# Altium schematic sheet 0.Block_Diagram_main.SchDoc
size A4; SheetNumber: 1; SheetTotal: 7
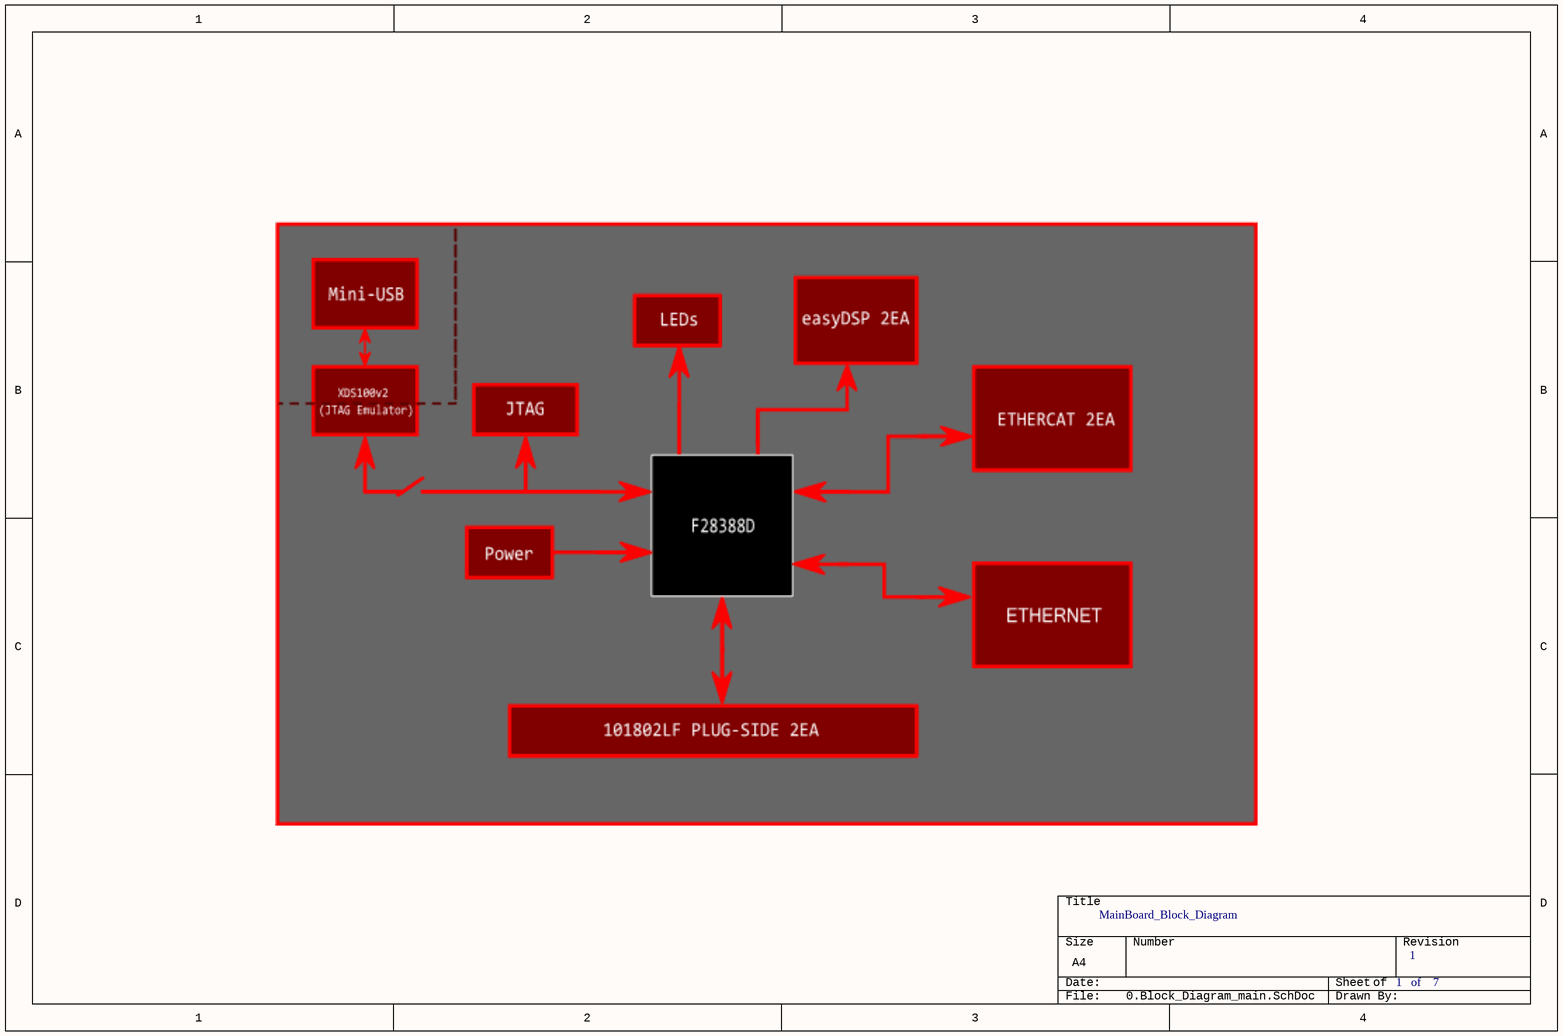
[diagram p0: 0.Block_Diagram_main.SchDoc]

## Notes on the sheet
- LEDs
- MainBoard_Block_Diagram
- 1   of    7
- 1